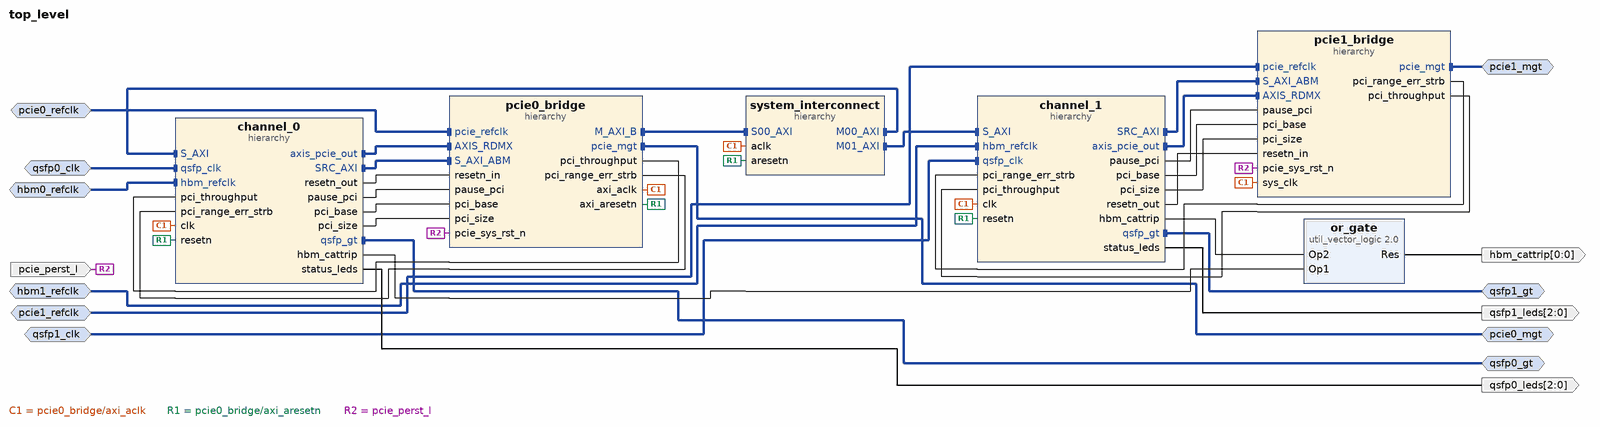
[diagram p0: block diagram of the top level]
# Vivado block design top_level, xcu55c-fsvh2892-2L-e, Vivado 2024.2
create_bd_design top_level

create_bd_intf_port -mode Slave -vlnv xilinx.com:interface:diff_clock_rtl:1.0 pcie0_refclk
create_bd_intf_port -mode Master -vlnv xilinx.com:interface:pcie_7x_mgt_rtl:1.0 pcie0_mgt
create_bd_intf_port -mode Slave -vlnv xilinx.com:interface:diff_clock_rtl:1.0 qsfp0_clk
set_property -dict {CONFIG.FREQ_HZ 161132812} [get_bd_intf_ports qsfp0_clk]
create_bd_intf_port -mode Master -vlnv xilinx.com:interface:gt_rtl:1.0 qsfp0_gt
create_bd_intf_port -mode Slave -vlnv xilinx.com:interface:diff_clock_rtl:1.0 hbm0_refclk
create_bd_intf_port -mode Master -vlnv xilinx.com:interface:pcie_7x_mgt_rtl:1.0 pcie1_mgt
create_bd_intf_port -mode Slave -vlnv xilinx.com:interface:diff_clock_rtl:1.0 pcie1_refclk
create_bd_intf_port -mode Slave -vlnv xilinx.com:interface:diff_clock_rtl:1.0 qsfp1_clk
set_property -dict {CONFIG.FREQ_HZ 161132812} [get_bd_intf_ports qsfp1_clk]
create_bd_intf_port -mode Master -vlnv xilinx.com:interface:gt_rtl:1.0 qsfp1_gt
create_bd_intf_port -mode Slave -vlnv xilinx.com:interface:diff_clock_rtl:1.0 hbm1_refclk
create_bd_port -dir O -from 2 -to 0 qsfp0_leds
create_bd_port -dir O -from 2 -to 0 qsfp1_leds
create_bd_port -dir I -type rst pcie_perst_l
create_bd_port -dir O -from 0 -to 0 hbm_cattrip

create_bd_cell -type hier pcie0_bridge
create_bd_cell -type hier system_interconnect
create_bd_cell -type hier channel_0
create_bd_cell -type hier pcie1_bridge
create_bd_cell -type hier channel_1
create_bd_cell -type ip -vlnv xilinx.com:ip:util_vector_logic:2.0 or_gate
set_property -dict {CONFIG.C_OPERATION or CONFIG.C_SIZE 1} [get_bd_cells or_gate]

# ---- hierarchy /pcie0_bridge ----
current_bd_instance /pcie0_bridge
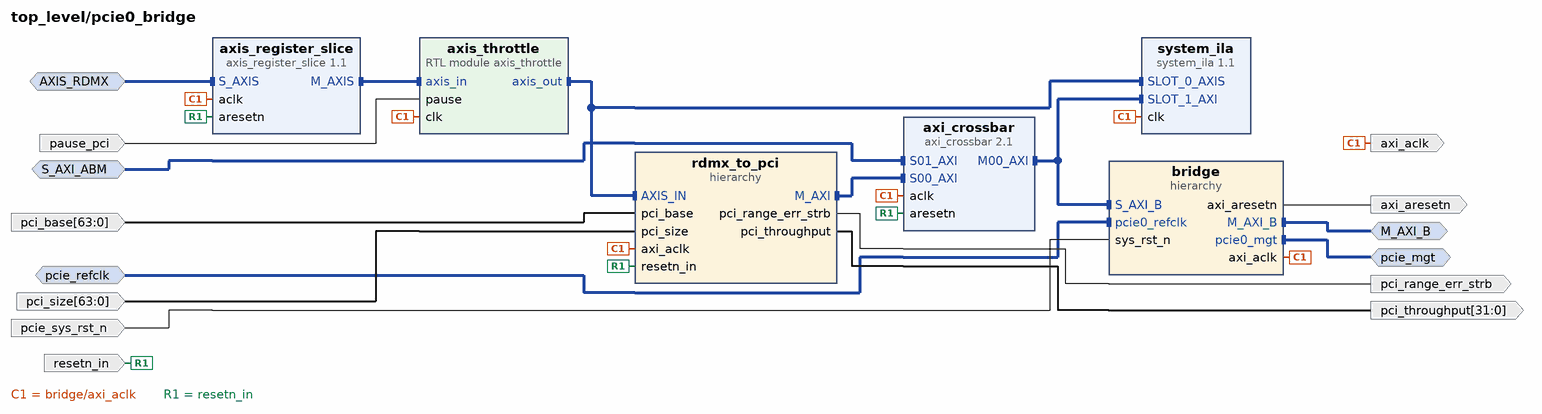
[diagram p1: block diagram inside /pcie0_bridge]
create_bd_intf_pin -mode Master -vlnv xilinx.com:interface:pcie_7x_mgt_rtl:1.0 pcie_mgt
create_bd_intf_pin -mode Slave -vlnv xilinx.com:interface:diff_clock_rtl:1.0 pcie_refclk
create_bd_intf_pin -mode Master -vlnv xilinx.com:interface:aximm_rtl:1.0 M_AXI_B
create_bd_intf_pin -mode Slave -vlnv xilinx.com:interface:axis_rtl:1.0 AXIS_RDMX
create_bd_intf_pin -mode Slave -vlnv xilinx.com:interface:aximm_rtl:1.0 S_AXI_ABM
create_bd_pin -dir O axi_aclk
create_bd_pin -dir O axi_aresetn
create_bd_pin -dir I resetn_in
create_bd_pin -dir O pci_range_err_strb
create_bd_pin -dir I pause_pci
create_bd_pin -dir I -from 63 -to 0 pci_base
create_bd_pin -dir I -from 63 -to 0 pci_size
create_bd_pin -dir I pcie_sys_rst_n
create_bd_pin -dir O -from 31 -to 0 pci_throughput

create_bd_cell -type ip -vlnv xilinx.com:ip:axis_register_slice:1.1 axis_register_slice
set_property -dict {CONFIG.REG_CONFIG 8} [get_bd_cells axis_register_slice]
create_bd_cell -type module -reference axis_throttle axis_throttle
create_bd_cell -type ip -vlnv xilinx.com:ip:system_ila:1.1 system_ila
set_property -dict [list \
  CONFIG.C_MON_TYPE INTERFACE \
  CONFIG.C_NUM_MONITOR_SLOTS 2 \
  CONFIG.C_SLOT_0_INTF_TYPE xilinx.com:interface:axis_rtl:1.0 \
] [get_bd_cells system_ila]
create_bd_cell -type hier bridge
create_bd_cell -type ip -vlnv xilinx.com:ip:axi_crossbar:2.1 axi_crossbar
set_property -dict {CONFIG.NUM_MI 1 CONFIG.NUM_SI 2 CONFIG.STRATEGY 2} [get_bd_cells axi_crossbar]
create_bd_cell -type hier rdmx_to_pci

# ---- hierarchy /pcie0_bridge/bridge ----
current_bd_instance /pcie0_bridge/bridge
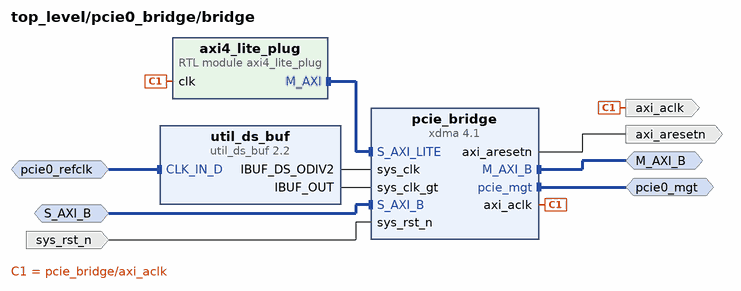
[diagram p2: block diagram inside /pcie0_bridge/bridge]
create_bd_intf_pin -mode Slave -vlnv xilinx.com:interface:diff_clock_rtl:1.0 pcie0_refclk
create_bd_intf_pin -mode Slave -vlnv xilinx.com:interface:aximm_rtl:1.0 S_AXI_B
create_bd_intf_pin -mode Master -vlnv xilinx.com:interface:aximm_rtl:1.0 M_AXI_B
create_bd_intf_pin -mode Master -vlnv xilinx.com:interface:pcie_7x_mgt_rtl:1.0 pcie0_mgt
create_bd_pin -dir O -type clk axi_aclk
create_bd_pin -dir I -type rst sys_rst_n
create_bd_pin -dir O -type rst axi_aresetn

create_bd_cell -type module -reference axi4_lite_plug axi4_lite_plug
create_bd_cell -type ip -vlnv xilinx.com:ip:util_ds_buf:2.2 util_ds_buf
set_property -dict {CONFIG.C_BUF_TYPE IBUFDSGTE} [get_bd_cells util_ds_buf]
create_bd_cell -type ip -vlnv xilinx.com:ip:xdma:4.1 pcie_bridge
set_property -dict [list \
  CONFIG.axi_addr_width 64 \
  CONFIG.functional_mode AXI_Bridge \
  CONFIG.mode_selection Advanced \
  CONFIG.pcie_blk_locn PCIE4C_X1Y1 \
  CONFIG.pf0_device_id 903f \
  CONFIG.pl_link_cap_max_link_speed 16.0_GT/s \
  CONFIG.pl_link_cap_max_link_width X8 \
] [get_bd_cells pcie_bridge]

# ---- hierarchy /pcie0_bridge/rdmx_to_pci ----
current_bd_instance /pcie0_bridge/rdmx_to_pci
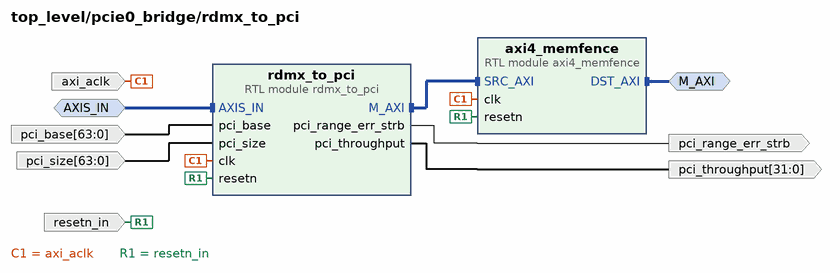
[diagram p3: block diagram inside /pcie0_bridge/rdmx_to_pci]
create_bd_intf_pin -mode Slave -vlnv xilinx.com:interface:axis_rtl:1.0 AXIS_IN
create_bd_intf_pin -mode Master -vlnv xilinx.com:interface:aximm_rtl:1.0 M_AXI
create_bd_pin -dir I -type clk axi_aclk
create_bd_pin -dir I resetn_in
create_bd_pin -dir I -from 63 -to 0 pci_base
create_bd_pin -dir I -from 63 -to 0 pci_size
create_bd_pin -dir O pci_range_err_strb
create_bd_pin -dir O -from 31 -to 0 pci_throughput

create_bd_cell -type module -reference rdmx_to_pci rdmx_to_pci
create_bd_cell -type module -reference axi4_memfence axi4_memfence

# ---- hierarchy /system_interconnect ----
current_bd_instance /system_interconnect
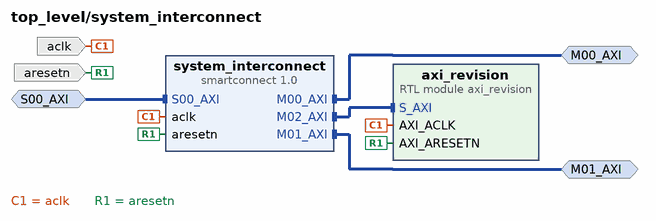
[diagram p4: block diagram inside /system_interconnect]
create_bd_intf_pin -mode Slave -vlnv xilinx.com:interface:aximm_rtl:1.0 S00_AXI
create_bd_intf_pin -mode Master -vlnv xilinx.com:interface:aximm_rtl:1.0 M01_AXI
create_bd_intf_pin -mode Master -vlnv xilinx.com:interface:aximm_rtl:1.0 M00_AXI
create_bd_pin -dir I -type clk aclk
create_bd_pin -dir I -type rst aresetn

create_bd_cell -type module -reference axi_revision axi_revision
create_bd_cell -type ip -vlnv xilinx.com:ip:smartconnect:1.0 system_interconnect
set_property -dict {CONFIG.NUM_MI 3 CONFIG.NUM_SI 1} [get_bd_cells system_interconnect]

# ---- hierarchy /channel_0 ----
current_bd_instance /channel_0
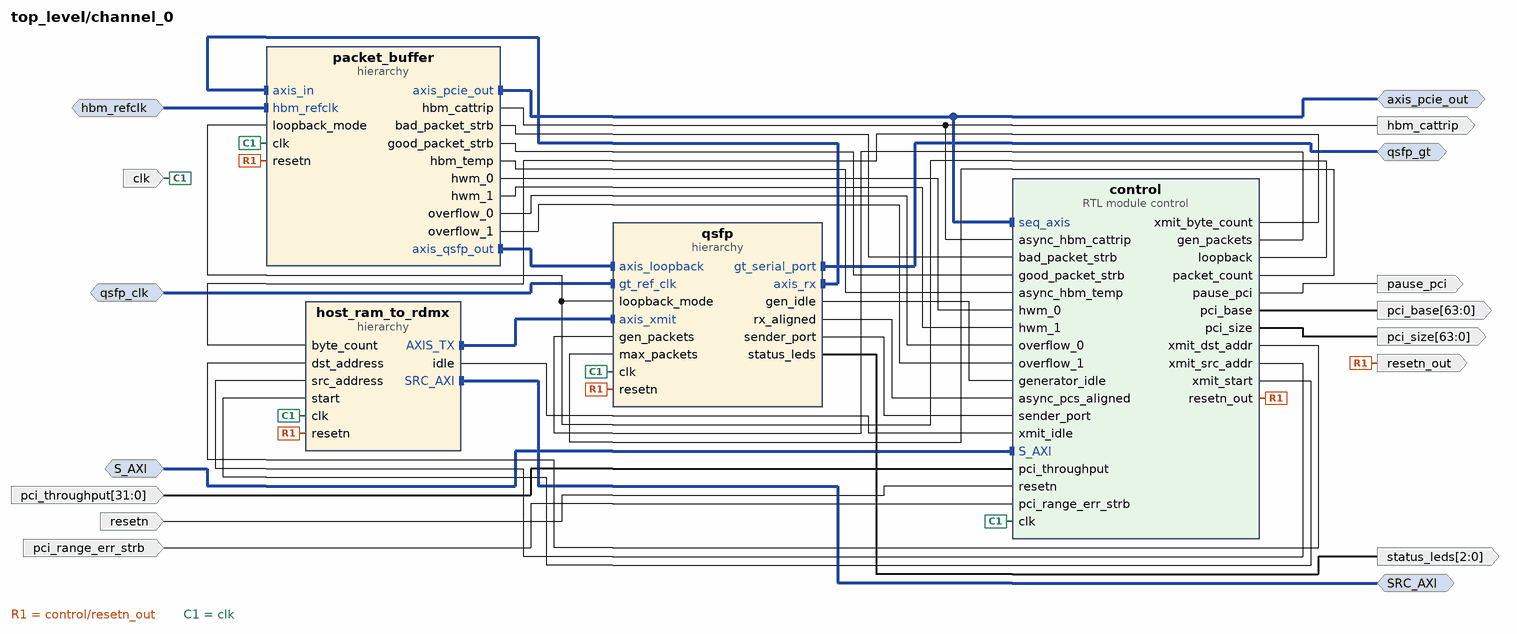
[diagram p5: block diagram inside /channel_0]
create_bd_intf_pin -mode Master -vlnv xilinx.com:interface:axis_rtl:1.0 axis_pcie_out
create_bd_intf_pin -mode Slave -vlnv xilinx.com:interface:aximm_rtl:1.0 S_AXI
create_bd_intf_pin -mode Master -vlnv xilinx.com:interface:aximm_rtl:1.0 SRC_AXI
create_bd_intf_pin -mode Slave -vlnv xilinx.com:interface:diff_clock_rtl:1.0 qsfp_clk
create_bd_intf_pin -mode Master -vlnv xilinx.com:interface:gt_rtl:1.0 qsfp_gt
create_bd_intf_pin -mode Slave -vlnv xilinx.com:interface:diff_clock_rtl:1.0 hbm_refclk
create_bd_pin -dir I -type clk clk
create_bd_pin -dir I -type rst resetn
create_bd_pin -dir O pause_pci
create_bd_pin -dir I pci_range_err_strb
create_bd_pin -dir O resetn_out
create_bd_pin -dir O -from 63 -to 0 pci_base
create_bd_pin -dir O -from 63 -to 0 pci_size
create_bd_pin -dir O -from 2 -to 0 status_leds
create_bd_pin -dir O hbm_cattrip
create_bd_pin -dir I -from 31 -to 0 pci_throughput

create_bd_cell -type hier host_ram_to_rdmx
create_bd_cell -type hier packet_buffer
create_bd_cell -type hier qsfp
create_bd_cell -type module -reference control control

# ---- hierarchy /channel_0/host_ram_to_rdmx ----
current_bd_instance /channel_0/host_ram_to_rdmx
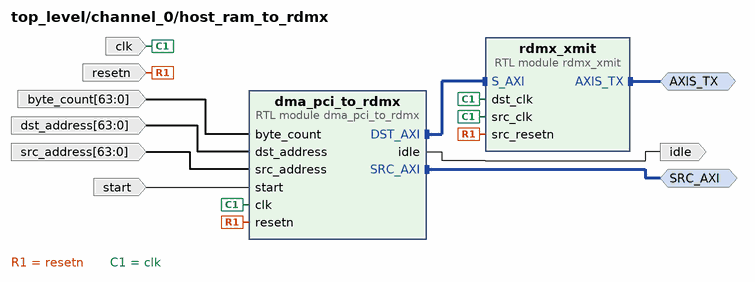
[diagram p6: block diagram inside /channel_0/host_ram_to_rdmx]
create_bd_intf_pin -mode Master -vlnv xilinx.com:interface:aximm_rtl:1.0 SRC_AXI
create_bd_intf_pin -mode Master -vlnv xilinx.com:interface:axis_rtl:1.0 AXIS_TX
create_bd_pin -dir I -type clk clk
create_bd_pin -dir I -type rst resetn
create_bd_pin -dir I -from 63 -to 0 src_address
create_bd_pin -dir I start
create_bd_pin -dir O idle
create_bd_pin -dir I -from 63 -to 0 dst_address
create_bd_pin -dir I -from 63 -to 0 byte_count

create_bd_cell -type module -reference rdmx_xmit rdmx_xmit
set_property -dict {CONFIG.FIFO_CLOCK_MODE common_clock CONFIG.SRC_MAC 0} [get_bd_cells rdmx_xmit]
create_bd_cell -type module -reference dma_pci_to_rdmx dma_pci_to_rdmx

# ---- hierarchy /channel_0/packet_buffer ----
current_bd_instance /channel_0/packet_buffer
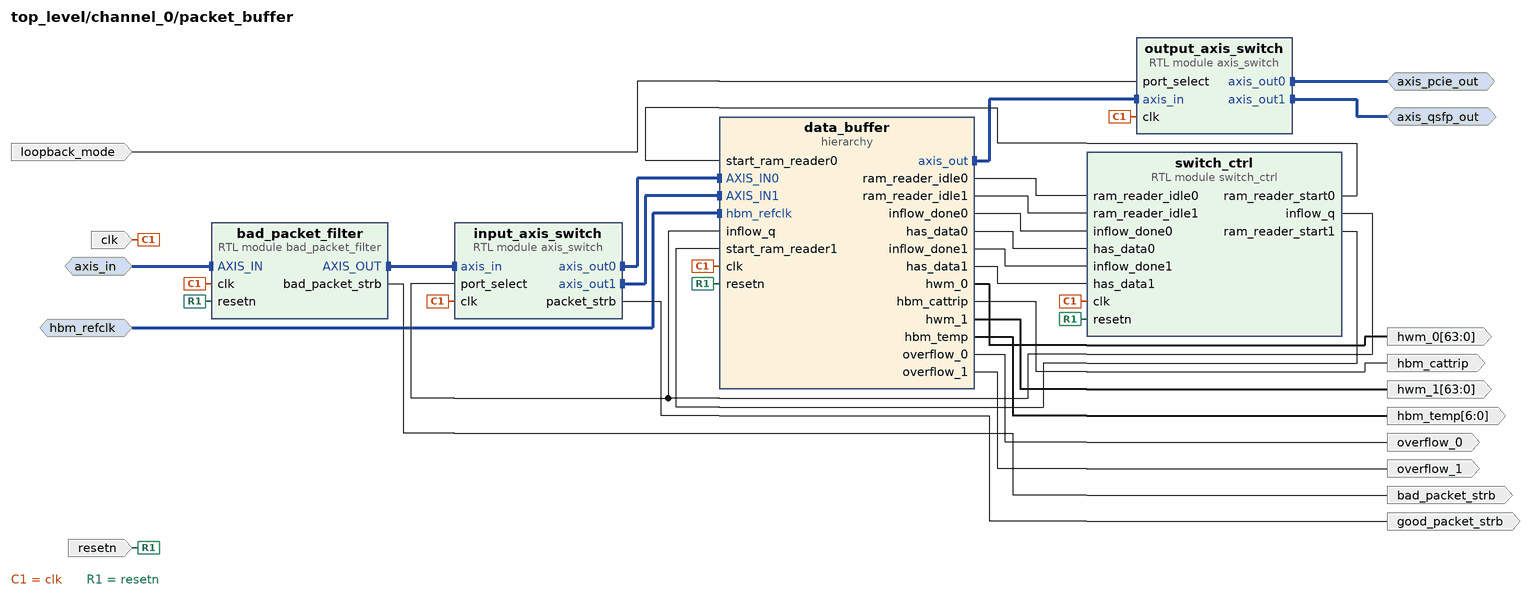
[diagram p7: block diagram inside /channel_0/packet_buffer]
create_bd_intf_pin -mode Slave -vlnv xilinx.com:interface:axis_rtl:1.0 axis_in
create_bd_intf_pin -mode Master -vlnv xilinx.com:interface:axis_rtl:1.0 axis_pcie_out
create_bd_intf_pin -mode Master -vlnv xilinx.com:interface:axis_rtl:1.0 axis_qsfp_out
create_bd_intf_pin -mode Slave -vlnv xilinx.com:interface:diff_clock_rtl:1.0 hbm_refclk
create_bd_pin -dir I -type clk clk
create_bd_pin -dir I resetn
create_bd_pin -dir O -from 63 -to 0 hwm_0
create_bd_pin -dir O -from 63 -to 0 hwm_1
create_bd_pin -dir I loopback_mode
create_bd_pin -dir O overflow_0
create_bd_pin -dir O overflow_1
create_bd_pin -dir O bad_packet_strb
create_bd_pin -dir O good_packet_strb
create_bd_pin -dir O -from 6 -to 0 hbm_temp
create_bd_pin -dir O hbm_cattrip

create_bd_cell -type module -reference axis_switch input_axis_switch
create_bd_cell -type module -reference axis_switch output_axis_switch
create_bd_cell -type module -reference switch_ctrl switch_ctrl
create_bd_cell -type hier data_buffer
create_bd_cell -type module -reference bad_packet_filter bad_packet_filter

# ---- hierarchy /channel_0/packet_buffer/data_buffer ----
current_bd_instance /channel_0/packet_buffer/data_buffer
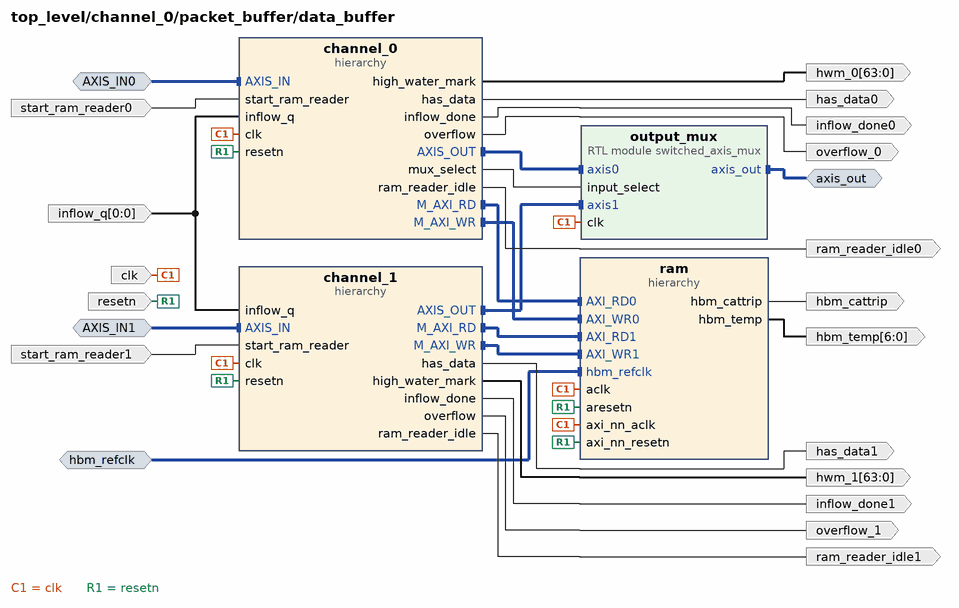
[diagram p8: block diagram inside /channel_0/packet_buffer/data_buffer]
create_bd_intf_pin -mode Slave -vlnv xilinx.com:interface:diff_clock_rtl:1.0 hbm_refclk
create_bd_intf_pin -mode Slave -vlnv xilinx.com:interface:axis_rtl:1.0 AXIS_IN0
create_bd_intf_pin -mode Slave -vlnv xilinx.com:interface:axis_rtl:1.0 AXIS_IN1
create_bd_intf_pin -mode Master -vlnv xilinx.com:interface:axis_rtl:1.0 axis_out
create_bd_pin -dir I -type clk clk
create_bd_pin -dir I resetn
create_bd_pin -dir O -from 6 -to 0 hbm_temp
create_bd_pin -dir O hbm_cattrip
create_bd_pin -dir I -from 0 -to 0 inflow_q
create_bd_pin -dir O ram_reader_idle0
create_bd_pin -dir I start_ram_reader0
create_bd_pin -dir O has_data0
create_bd_pin -dir O inflow_done0
create_bd_pin -dir O -from 63 -to 0 hwm_0
create_bd_pin -dir O overflow_0
create_bd_pin -dir O has_data1
create_bd_pin -dir O inflow_done1
create_bd_pin -dir O -from 63 -to 0 hwm_1
create_bd_pin -dir O overflow_1
create_bd_pin -dir O ram_reader_idle1
create_bd_pin -dir I start_ram_reader1

create_bd_cell -type hier ram
create_bd_cell -type hier channel_0
create_bd_cell -type hier channel_1
create_bd_cell -type module -reference switched_axis_mux output_mux

# ---- hierarchy /channel_0/packet_buffer/data_buffer/ram ----
current_bd_instance /channel_0/packet_buffer/data_buffer/ram
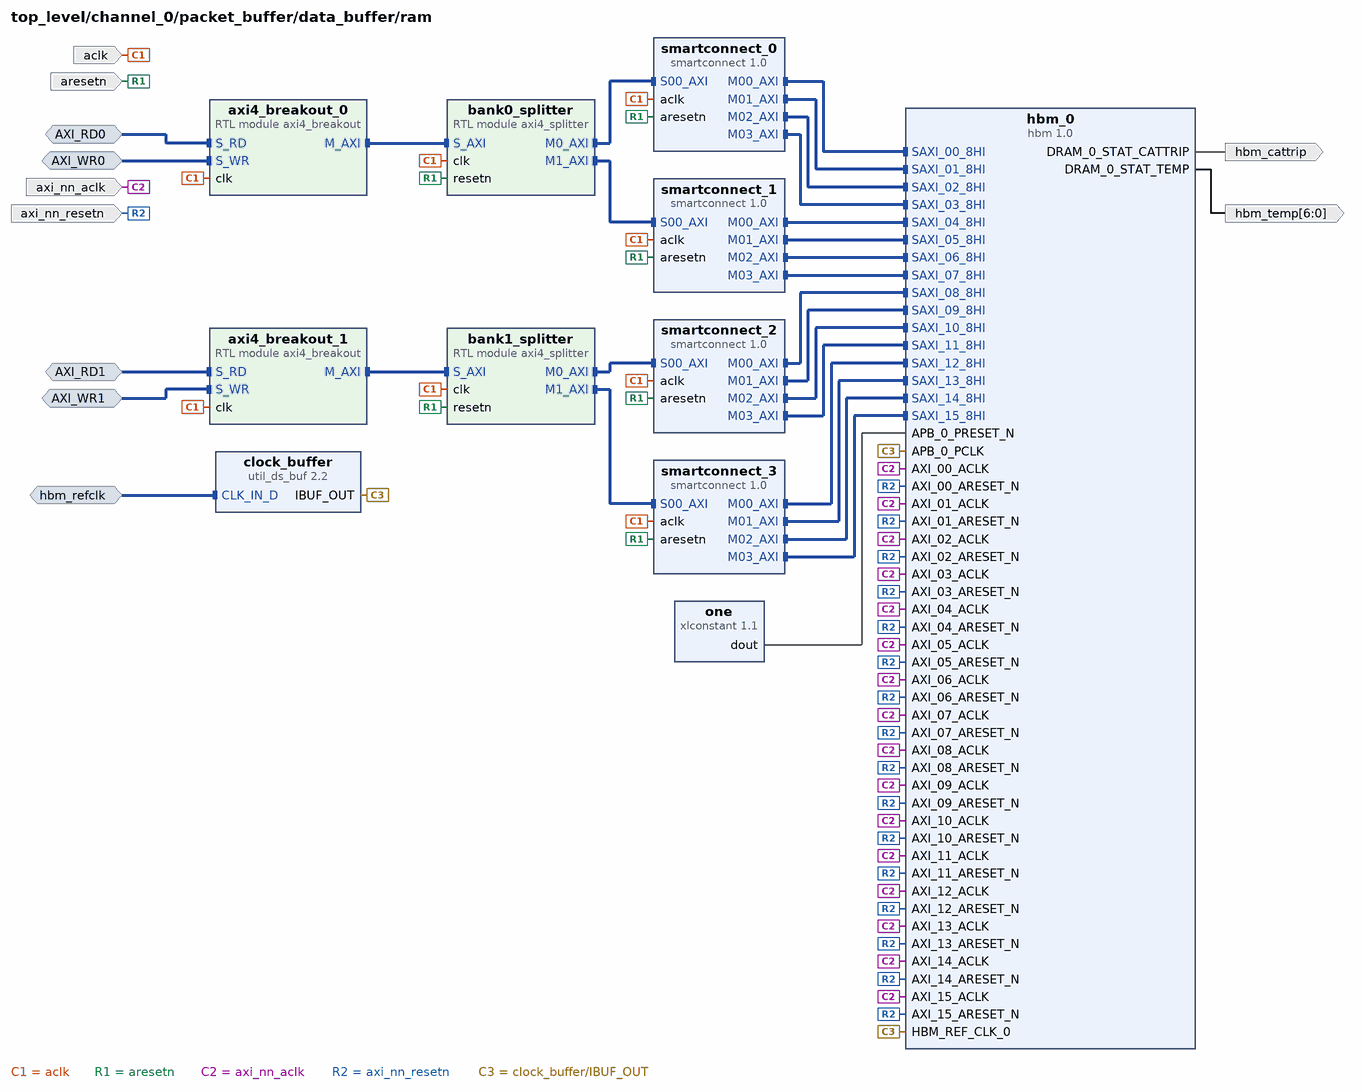
[diagram p9: block diagram inside /channel_0/packet_buffer/data_buffer/ram]
create_bd_intf_pin -mode Slave -vlnv xilinx.com:interface:aximm_rtl:1.0 AXI_WR1
create_bd_intf_pin -mode Slave -vlnv xilinx.com:interface:aximm_rtl:1.0 AXI_RD1
create_bd_intf_pin -mode Slave -vlnv xilinx.com:interface:aximm_rtl:1.0 AXI_WR0
create_bd_intf_pin -mode Slave -vlnv xilinx.com:interface:aximm_rtl:1.0 AXI_RD0
create_bd_intf_pin -mode Slave -vlnv xilinx.com:interface:diff_clock_rtl:1.0 hbm_refclk
create_bd_pin -dir I -type clk axi_nn_aclk
create_bd_pin -dir I axi_nn_resetn
create_bd_pin -dir O -from 6 -to 0 hbm_temp
create_bd_pin -dir O hbm_cattrip
create_bd_pin -dir I aclk
create_bd_pin -dir I aresetn

create_bd_cell -type ip -vlnv xilinx.com:ip:hbm:1.0 hbm_0
set_property -dict [list \
  CONFIG.USER_APB_EN false \
  CONFIG.USER_MC0_ENABLE_ECC_CORRECTION true \
  CONFIG.USER_MC0_TRAFFIC_OPTION Linear \
  CONFIG.USER_MC10_ENABLE_ECC_CORRECTION true \
  CONFIG.USER_MC10_TRAFFIC_OPTION Linear \
  CONFIG.USER_MC11_ENABLE_ECC_CORRECTION true \
  CONFIG.USER_MC11_TRAFFIC_OPTION Linear \
  CONFIG.USER_MC12_ENABLE_ECC_CORRECTION true \
  CONFIG.USER_MC12_TRAFFIC_OPTION Linear \
  CONFIG.USER_MC13_ENABLE_ECC_CORRECTION true \
  CONFIG.USER_MC13_TRAFFIC_OPTION Linear \
  CONFIG.USER_MC14_ENABLE_ECC_CORRECTION true \
  CONFIG.USER_MC14_TRAFFIC_OPTION Linear \
  CONFIG.USER_MC15_ENABLE_ECC_CORRECTION true \
  CONFIG.USER_MC15_TRAFFIC_OPTION Linear \
  CONFIG.USER_MC1_ENABLE_ECC_CORRECTION true \
  CONFIG.USER_MC1_TRAFFIC_OPTION Linear \
  CONFIG.USER_MC2_ENABLE_ECC_CORRECTION true \
  CONFIG.USER_MC2_TRAFFIC_OPTION Linear \
  CONFIG.USER_MC3_ENABLE_ECC_CORRECTION true \
  CONFIG.USER_MC3_TRAFFIC_OPTION Linear \
  CONFIG.USER_MC4_ENABLE_ECC_CORRECTION true \
  CONFIG.USER_MC4_TRAFFIC_OPTION Linear \
  CONFIG.USER_MC5_ENABLE_ECC_CORRECTION true \
  CONFIG.USER_MC5_TRAFFIC_OPTION Linear \
  CONFIG.USER_MC6_ENABLE_ECC_CORRECTION true \
  CONFIG.USER_MC6_TRAFFIC_OPTION Linear \
  CONFIG.USER_MC7_ENABLE_ECC_CORRECTION true \
  CONFIG.USER_MC7_TRAFFIC_OPTION Linear \
  CONFIG.USER_MC8_ENABLE_ECC_CORRECTION true \
  CONFIG.USER_MC8_TRAFFIC_OPTION Linear \
  CONFIG.USER_MC9_ENABLE_ECC_CORRECTION true \
  CONFIG.USER_MC9_TRAFFIC_OPTION Linear \
  CONFIG.USER_SWITCH_ENABLE_00 FALSE \
] [get_bd_cells hbm_0]
create_bd_cell -type ip -vlnv xilinx.com:ip:smartconnect:1.0 smartconnect_0
set_property -dict {CONFIG.NUM_MI 4 CONFIG.NUM_SI 1} [get_bd_cells smartconnect_0]
create_bd_cell -type ip -vlnv xilinx.com:ip:smartconnect:1.0 smartconnect_1
set_property -dict {CONFIG.NUM_MI 4 CONFIG.NUM_SI 1} [get_bd_cells smartconnect_1]
create_bd_cell -type ip -vlnv xilinx.com:ip:smartconnect:1.0 smartconnect_2
set_property -dict {CONFIG.NUM_MI 4 CONFIG.NUM_SI 1} [get_bd_cells smartconnect_2]
create_bd_cell -type ip -vlnv xilinx.com:ip:smartconnect:1.0 smartconnect_3
set_property -dict {CONFIG.NUM_MI 4 CONFIG.NUM_SI 1} [get_bd_cells smartconnect_3]
create_bd_cell -type ip -vlnv xilinx.com:ip:xlconstant:1.1 one
create_bd_cell -type ip -vlnv xilinx.com:ip:util_ds_buf:2.2 clock_buffer
create_bd_cell -type module -reference axi4_breakout axi4_breakout_0
create_bd_cell -type module -reference axi4_breakout axi4_breakout_1
create_bd_cell -type module -reference axi4_splitter bank0_splitter
set_property -dict {CONFIG.BASE_ADDR1 0x0000000080000000} [get_bd_cells bank0_splitter]
create_bd_cell -type module -reference axi4_splitter bank1_splitter
set_property -dict {CONFIG.BASE_ADDR0 0x0000000100000000 CONFIG.BASE_ADDR1 0x0000000180000000} [get_bd_cells bank1_splitter]

# ---- hierarchy /channel_0/packet_buffer/data_buffer/channel_0 ----
current_bd_instance /channel_0/packet_buffer/data_buffer/channel_0
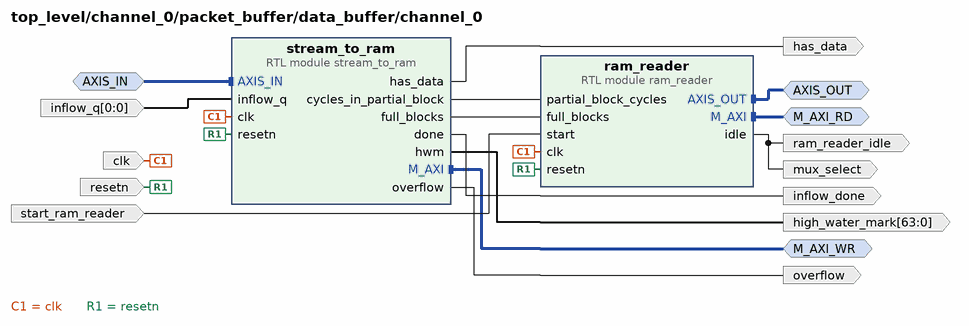
[diagram p10: block diagram inside /channel_0/packet_buffer/data_buffer/channel_0]
create_bd_intf_pin -mode Slave -vlnv xilinx.com:interface:axis_rtl:1.0 AXIS_IN
create_bd_intf_pin -mode Master -vlnv xilinx.com:interface:axis_rtl:1.0 AXIS_OUT
create_bd_intf_pin -mode Master -vlnv xilinx.com:interface:aximm_rtl:1.0 M_AXI_WR
create_bd_intf_pin -mode Master -vlnv xilinx.com:interface:aximm_rtl:1.0 M_AXI_RD
create_bd_pin -dir I -type clk clk
create_bd_pin -dir I resetn
create_bd_pin -dir I -from 0 -to 0 inflow_q
create_bd_pin -dir O ram_reader_idle
create_bd_pin -dir I start_ram_reader
create_bd_pin -dir O has_data
create_bd_pin -dir O inflow_done
create_bd_pin -dir O -from 63 -to 0 high_water_mark
create_bd_pin -dir O overflow
create_bd_pin -dir O mux_select

create_bd_cell -type module -reference stream_to_ram stream_to_ram
create_bd_cell -type module -reference ram_reader ram_reader

# ---- hierarchy /channel_0/packet_buffer/data_buffer/channel_1 ----
current_bd_instance /channel_0/packet_buffer/data_buffer/channel_1
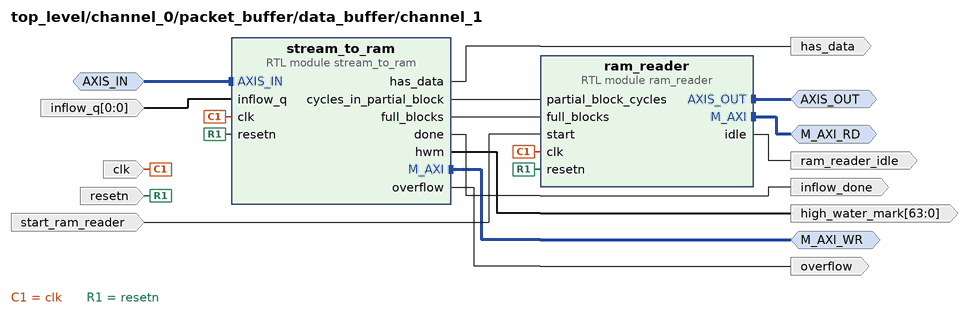
[diagram p11: block diagram inside /channel_0/packet_buffer/data_buffer/channel_1]
create_bd_intf_pin -mode Slave -vlnv xilinx.com:interface:axis_rtl:1.0 AXIS_IN
create_bd_intf_pin -mode Master -vlnv xilinx.com:interface:aximm_rtl:1.0 M_AXI_WR
create_bd_intf_pin -mode Master -vlnv xilinx.com:interface:axis_rtl:1.0 AXIS_OUT
create_bd_intf_pin -mode Master -vlnv xilinx.com:interface:aximm_rtl:1.0 M_AXI_RD
create_bd_pin -dir I -type clk clk
create_bd_pin -dir I resetn
create_bd_pin -dir I -from 0 -to 0 inflow_q
create_bd_pin -dir O has_data
create_bd_pin -dir O inflow_done
create_bd_pin -dir O -from 63 -to 0 high_water_mark
create_bd_pin -dir O overflow
create_bd_pin -dir O ram_reader_idle
create_bd_pin -dir I start_ram_reader

create_bd_cell -type module -reference stream_to_ram stream_to_ram
set_property -dict {CONFIG.CHANNEL 1} [get_bd_cells stream_to_ram]
create_bd_cell -type module -reference ram_reader ram_reader

# ---- hierarchy /channel_0/qsfp ----
current_bd_instance /channel_0/qsfp
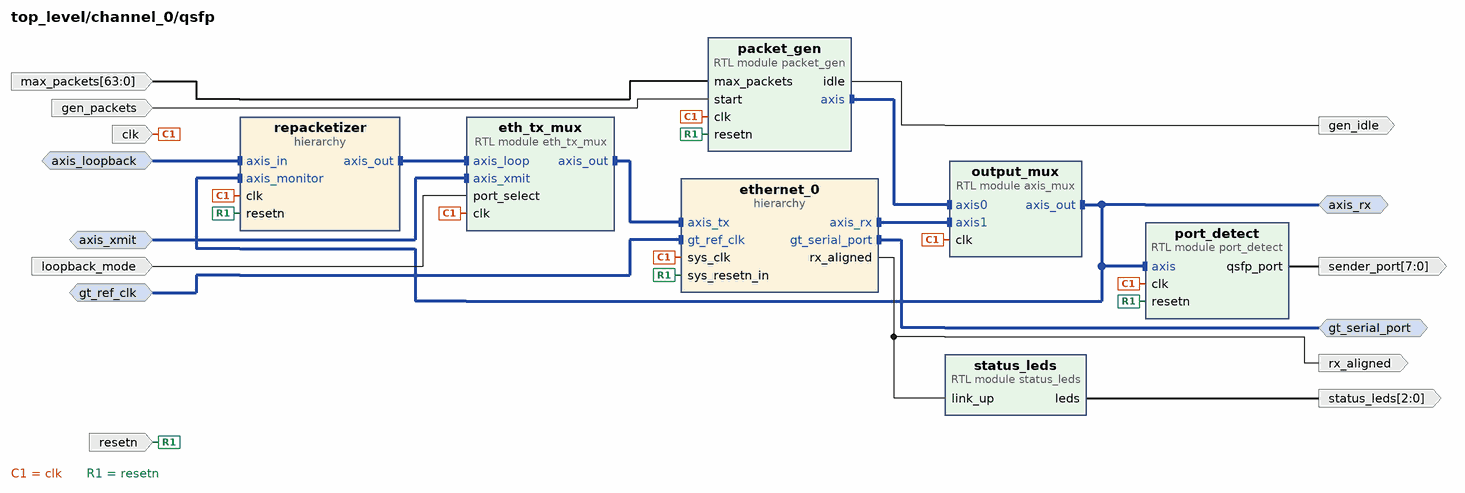
[diagram p12: block diagram inside /channel_0/qsfp]
create_bd_intf_pin -mode Master -vlnv xilinx.com:interface:axis_rtl:1.0 axis_rx
create_bd_intf_pin -mode Slave -vlnv xilinx.com:interface:diff_clock_rtl:1.0 gt_ref_clk
create_bd_intf_pin -mode Master -vlnv xilinx.com:interface:gt_rtl:1.0 gt_serial_port
create_bd_intf_pin -mode Slave -vlnv xilinx.com:interface:axis_rtl:1.0 axis_loopback
create_bd_intf_pin -mode Slave -vlnv xilinx.com:interface:axis_rtl:1.0 axis_xmit
create_bd_pin -dir I -type clk clk
create_bd_pin -dir I -type rst resetn
create_bd_pin -dir I gen_packets
create_bd_pin -dir I -from 63 -to 0 max_packets
create_bd_pin -dir O gen_idle
create_bd_pin -dir O rx_aligned
create_bd_pin -dir I loopback_mode
create_bd_pin -dir O -from 2 -to 0 status_leds
create_bd_pin -dir O -from 7 -to 0 sender_port

create_bd_cell -type hier ethernet_0
create_bd_cell -type hier repacketizer
create_bd_cell -type module -reference axis_mux output_mux
create_bd_cell -type module -reference eth_tx_mux eth_tx_mux
create_bd_cell -type module -reference packet_gen packet_gen
create_bd_cell -type module -reference status_leds status_leds
create_bd_cell -type module -reference port_detect port_detect

# ---- hierarchy /channel_0/qsfp/ethernet_0 ----
current_bd_instance /channel_0/qsfp/ethernet_0
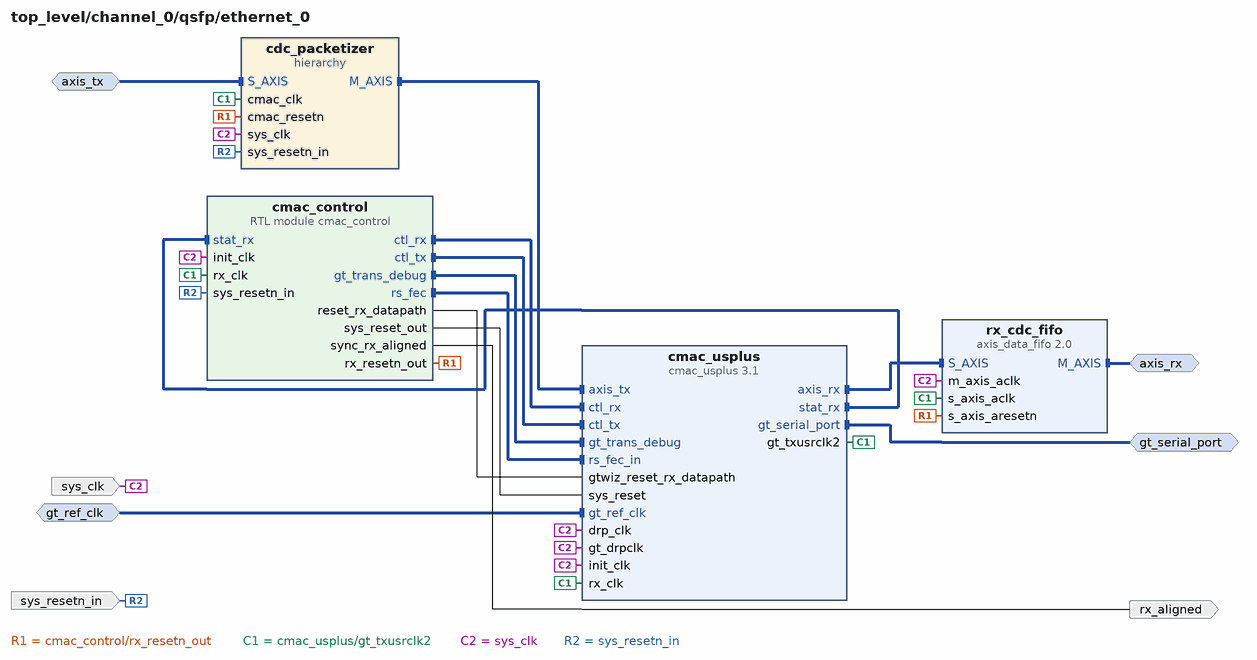
[diagram p13: block diagram inside /channel_0/qsfp/ethernet_0]
create_bd_intf_pin -mode Master -vlnv xilinx.com:interface:gt_rtl:1.0 gt_serial_port
create_bd_intf_pin -mode Slave -vlnv xilinx.com:interface:diff_clock_rtl:1.0 gt_ref_clk
create_bd_intf_pin -mode Master -vlnv xilinx.com:interface:axis_rtl:1.0 axis_rx
create_bd_intf_pin -mode Slave -vlnv xilinx.com:interface:axis_rtl:1.0 axis_tx
create_bd_pin -dir O rx_aligned
create_bd_pin -dir I sys_resetn_in
create_bd_pin -dir I sys_clk

create_bd_cell -type hier cdc_packetizer
create_bd_cell -type ip -vlnv xilinx.com:ip:axis_data_fifo:2.0 rx_cdc_fifo
set_property -dict {CONFIG.FIFO_DEPTH 16 CONFIG.IS_ACLK_ASYNC 1} [get_bd_cells rx_cdc_fifo]
create_bd_cell -type module -reference cmac_control cmac_control
create_bd_cell -type ip -vlnv xilinx.com:ip:cmac_usplus:3.1 cmac_usplus
set_property -dict [list \
  CONFIG.ADD_GT_CNRL_STS_PORTS 1 \
  CONFIG.CMAC_CAUI4_MODE 1 \
  CONFIG.CMAC_CORE_SELECT CMACE4_X0Y3 \
  CONFIG.GT_DRP_CLK 250 \
  CONFIG.GT_GROUP_SELECT {X0Y24~X0Y27} \
  CONFIG.GT_REF_CLK_FREQ 161.1328125 \
  CONFIG.INCLUDE_RS_FEC 1 \
  CONFIG.NUM_LANES 4x25 \
  CONFIG.RX_FLOW_CONTROL 0 \
  CONFIG.TX_FLOW_CONTROL 0 \
  CONFIG.USER_INTERFACE AXIS \
] [get_bd_cells cmac_usplus]

# ---- hierarchy /channel_0/qsfp/ethernet_0/cdc_packetizer ----
current_bd_instance /channel_0/qsfp/ethernet_0/cdc_packetizer
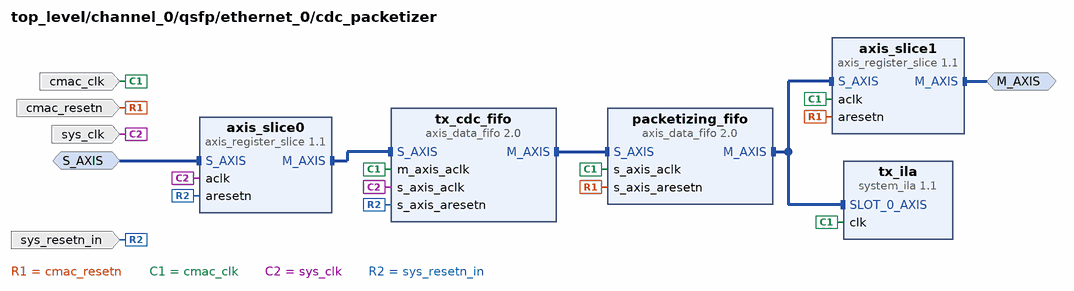
[diagram p14: block diagram inside /channel_0/qsfp/ethernet_0/cdc_packetizer]
create_bd_intf_pin -mode Slave -vlnv xilinx.com:interface:axis_rtl:1.0 S_AXIS
create_bd_intf_pin -mode Master -vlnv xilinx.com:interface:axis_rtl:1.0 M_AXIS
create_bd_pin -dir I sys_resetn_in
create_bd_pin -dir I sys_clk
create_bd_pin -dir I -type clk cmac_clk
create_bd_pin -dir I -type rst cmac_resetn

create_bd_cell -type ip -vlnv xilinx.com:ip:axis_data_fifo:2.0 tx_cdc_fifo
set_property -dict {CONFIG.FIFO_DEPTH 16 CONFIG.IS_ACLK_ASYNC 1} [get_bd_cells tx_cdc_fifo]
create_bd_cell -type ip -vlnv xilinx.com:ip:system_ila:1.1 tx_ila
set_property -dict {CONFIG.C_MON_TYPE INTERFACE CONFIG.C_SLOT_0_INTF_TYPE xilinx.com:interface:axis_rtl:1.0} [get_bd_cells tx_ila]
create_bd_cell -type ip -vlnv xilinx.com:ip:axis_data_fifo:2.0 packetizing_fifo
set_property -dict {CONFIG.FIFO_DEPTH 256 CONFIG.FIFO_MODE 2 CONFIG.IS_ACLK_ASYNC 0} [get_bd_cells packetizing_fifo]
create_bd_cell -type ip -vlnv xilinx.com:ip:axis_register_slice:1.1 axis_slice0
set_property -dict {CONFIG.REG_CONFIG 8} [get_bd_cells axis_slice0]
create_bd_cell -type ip -vlnv xilinx.com:ip:axis_register_slice:1.1 axis_slice1
set_property -dict {CONFIG.REG_CONFIG 8} [get_bd_cells axis_slice1]

# ---- hierarchy /channel_0/qsfp/repacketizer ----
current_bd_instance /channel_0/qsfp/repacketizer
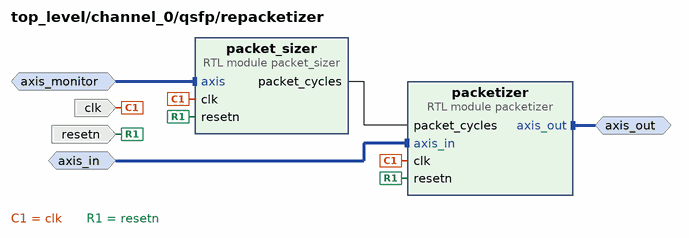
[diagram p15: block diagram inside /channel_0/qsfp/repacketizer]
create_bd_intf_pin -mode Monitor -vlnv xilinx.com:interface:axis_rtl:1.0 axis_monitor
create_bd_intf_pin -mode Slave -vlnv xilinx.com:interface:axis_rtl:1.0 axis_in
create_bd_intf_pin -mode Master -vlnv xilinx.com:interface:axis_rtl:1.0 axis_out
create_bd_pin -dir I -type clk clk
create_bd_pin -dir I -type rst resetn

create_bd_cell -type module -reference packet_sizer packet_sizer
create_bd_cell -type module -reference packetizer packetizer

# ---- hierarchy /pcie1_bridge ----
current_bd_instance /pcie1_bridge
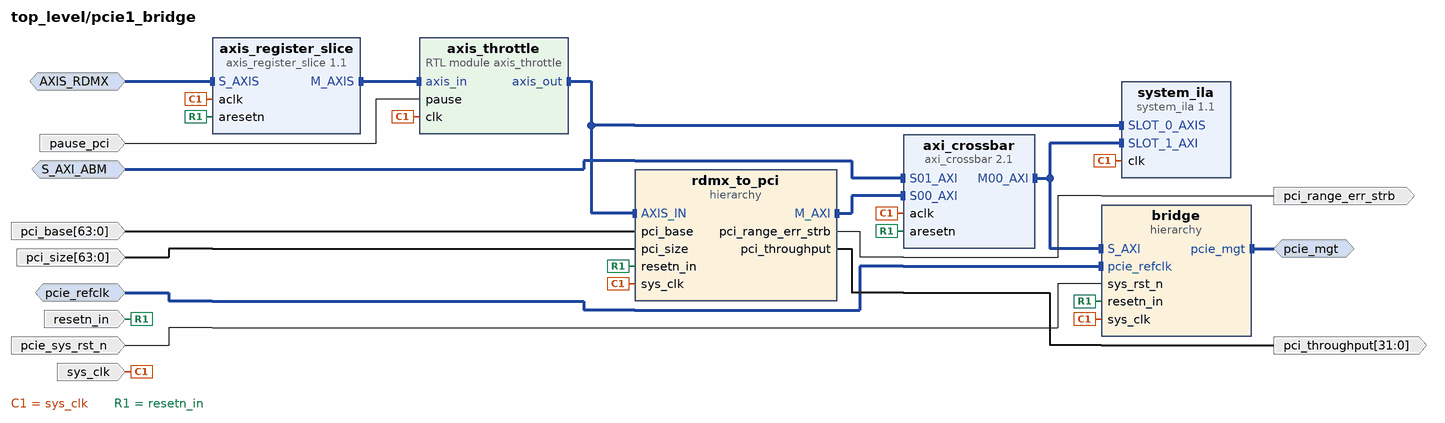
[diagram p16: block diagram inside /pcie1_bridge]
create_bd_intf_pin -mode Master -vlnv xilinx.com:interface:pcie_7x_mgt_rtl:1.0 pcie_mgt
create_bd_intf_pin -mode Slave -vlnv xilinx.com:interface:diff_clock_rtl:1.0 pcie_refclk
create_bd_intf_pin -mode Slave -vlnv xilinx.com:interface:axis_rtl:1.0 AXIS_RDMX
create_bd_intf_pin -mode Slave -vlnv xilinx.com:interface:aximm_rtl:1.0 S_AXI_ABM
create_bd_pin -dir I resetn_in
create_bd_pin -dir O pci_range_err_strb
create_bd_pin -dir I pause_pci
create_bd_pin -dir I -from 63 -to 0 pci_base
create_bd_pin -dir I -from 63 -to 0 pci_size
create_bd_pin -dir I sys_clk
create_bd_pin -dir I -type rst pcie_sys_rst_n
create_bd_pin -dir O -from 31 -to 0 pci_throughput

create_bd_cell -type ip -vlnv xilinx.com:ip:axis_register_slice:1.1 axis_register_slice
set_property -dict {CONFIG.REG_CONFIG 8} [get_bd_cells axis_register_slice]
create_bd_cell -type module -reference axis_throttle axis_throttle
create_bd_cell -type ip -vlnv xilinx.com:ip:system_ila:1.1 system_ila
set_property -dict [list \
  CONFIG.C_MON_TYPE INTERFACE \
  CONFIG.C_NUM_MONITOR_SLOTS 2 \
  CONFIG.C_SLOT_0_INTF_TYPE xilinx.com:interface:axis_rtl:1.0 \
] [get_bd_cells system_ila]
create_bd_cell -type hier bridge
create_bd_cell -type ip -vlnv xilinx.com:ip:axi_crossbar:2.1 axi_crossbar
set_property -dict {CONFIG.NUM_MI 1 CONFIG.NUM_SI 2 CONFIG.STRATEGY 2} [get_bd_cells axi_crossbar]
create_bd_cell -type hier rdmx_to_pci

# ---- hierarchy /pcie1_bridge/bridge ----
current_bd_instance /pcie1_bridge/bridge
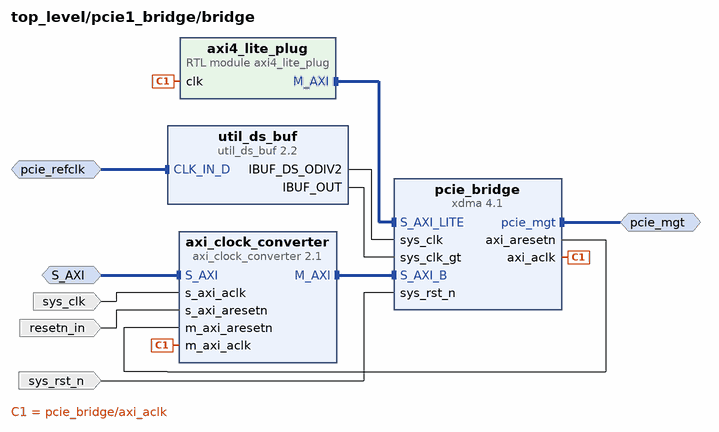
[diagram p17: block diagram inside /pcie1_bridge/bridge]
create_bd_intf_pin -mode Slave -vlnv xilinx.com:interface:aximm_rtl:1.0 S_AXI
create_bd_intf_pin -mode Master -vlnv xilinx.com:interface:pcie_7x_mgt_rtl:1.0 pcie_mgt
create_bd_intf_pin -mode Slave -vlnv xilinx.com:interface:diff_clock_rtl:1.0 pcie_refclk
create_bd_pin -dir I sys_clk
create_bd_pin -dir I resetn_in
create_bd_pin -dir I -type rst sys_rst_n

create_bd_cell -type ip -vlnv xilinx.com:ip:axi_clock_converter:2.1 axi_clock_converter
create_bd_cell -type ip -vlnv xilinx.com:ip:util_ds_buf:2.2 util_ds_buf
set_property -dict {CONFIG.C_BUF_TYPE IBUFDSGTE} [get_bd_cells util_ds_buf]
create_bd_cell -type module -reference axi4_lite_plug axi4_lite_plug
create_bd_cell -type ip -vlnv xilinx.com:ip:xdma:4.1 pcie_bridge
set_property -dict [list \
  CONFIG.axi_addr_width 64 \
  CONFIG.en_axi_master_if false \
  CONFIG.en_gt_selection true \
  CONFIG.functional_mode AXI_Bridge \
  CONFIG.mode_selection Advanced \
  CONFIG.pcie_blk_locn PCIE4C_X1Y0 \
  CONFIG.pf0_device_id 9040 \
  CONFIG.pl_link_cap_max_link_speed 16.0_GT/s \
  CONFIG.pl_link_cap_max_link_width X8 \
  CONFIG.select_quad GTY_Quad_225 \
] [get_bd_cells pcie_bridge]

# ---- hierarchy /pcie1_bridge/rdmx_to_pci ----
current_bd_instance /pcie1_bridge/rdmx_to_pci
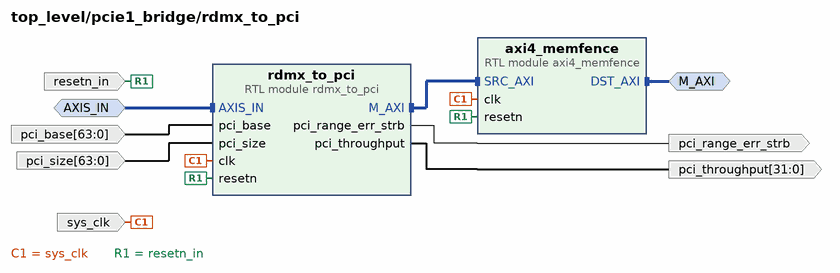
[diagram p18: block diagram inside /pcie1_bridge/rdmx_to_pci]
create_bd_intf_pin -mode Slave -vlnv xilinx.com:interface:axis_rtl:1.0 AXIS_IN
create_bd_intf_pin -mode Master -vlnv xilinx.com:interface:aximm_rtl:1.0 M_AXI
create_bd_pin -dir I sys_clk
create_bd_pin -dir I resetn_in
create_bd_pin -dir I -from 63 -to 0 pci_base
create_bd_pin -dir I -from 63 -to 0 pci_size
create_bd_pin -dir O pci_range_err_strb
create_bd_pin -dir O -from 31 -to 0 pci_throughput

create_bd_cell -type module -reference rdmx_to_pci rdmx_to_pci
create_bd_cell -type module -reference axi4_memfence axi4_memfence

# ---- hierarchy /channel_1 ----
current_bd_instance /channel_1
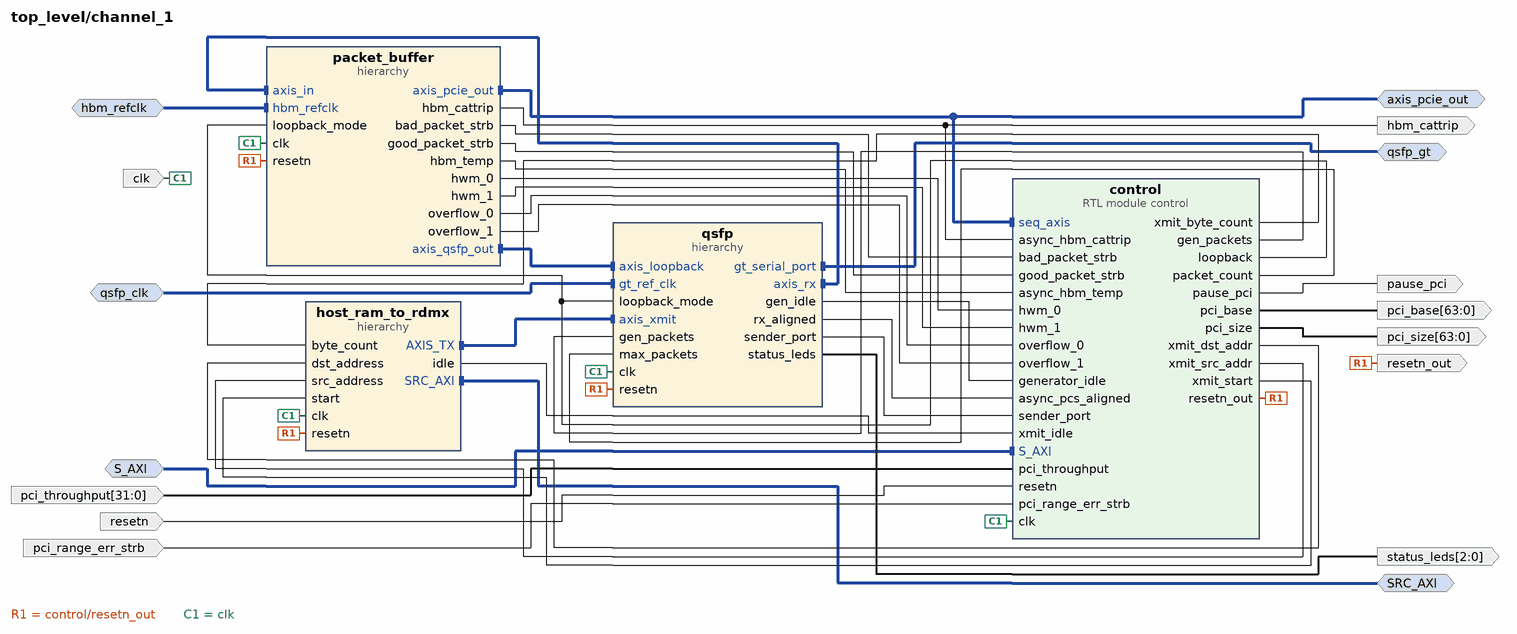
[diagram p19: block diagram inside /channel_1]
create_bd_intf_pin -mode Master -vlnv xilinx.com:interface:axis_rtl:1.0 axis_pcie_out
create_bd_intf_pin -mode Slave -vlnv xilinx.com:interface:aximm_rtl:1.0 S_AXI
create_bd_intf_pin -mode Master -vlnv xilinx.com:interface:aximm_rtl:1.0 SRC_AXI
create_bd_intf_pin -mode Slave -vlnv xilinx.com:interface:diff_clock_rtl:1.0 qsfp_clk
create_bd_intf_pin -mode Master -vlnv xilinx.com:interface:gt_rtl:1.0 qsfp_gt
create_bd_intf_pin -mode Slave -vlnv xilinx.com:interface:diff_clock_rtl:1.0 hbm_refclk
create_bd_pin -dir I -type clk clk
create_bd_pin -dir I -type rst resetn
create_bd_pin -dir O pause_pci
create_bd_pin -dir I pci_range_err_strb
create_bd_pin -dir O resetn_out
create_bd_pin -dir O -from 63 -to 0 pci_base
create_bd_pin -dir O -from 63 -to 0 pci_size
create_bd_pin -dir O -from 2 -to 0 status_leds
create_bd_pin -dir O hbm_cattrip
create_bd_pin -dir I -from 31 -to 0 pci_throughput

create_bd_cell -type hier host_ram_to_rdmx
create_bd_cell -type hier packet_buffer
create_bd_cell -type hier qsfp
create_bd_cell -type module -reference control control
set_property -dict {CONFIG.DEFAULT_PCI_BASE 0x0000000200000000} [get_bd_cells control]

# ---- hierarchy /channel_1/host_ram_to_rdmx ----
current_bd_instance /channel_1/host_ram_to_rdmx
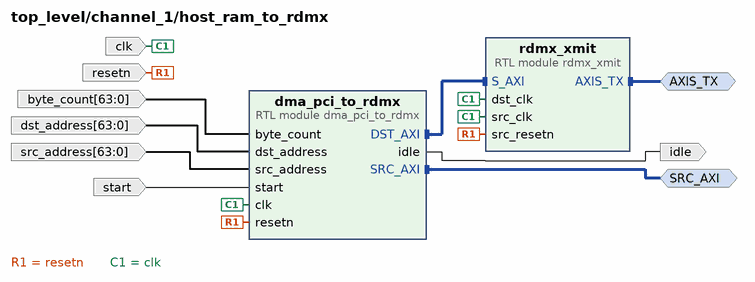
[diagram p20: block diagram inside /channel_1/host_ram_to_rdmx]
create_bd_intf_pin -mode Master -vlnv xilinx.com:interface:aximm_rtl:1.0 SRC_AXI
create_bd_intf_pin -mode Master -vlnv xilinx.com:interface:axis_rtl:1.0 AXIS_TX
create_bd_pin -dir I -type clk clk
create_bd_pin -dir I -type rst resetn
create_bd_pin -dir I -from 63 -to 0 src_address
create_bd_pin -dir I start
create_bd_pin -dir O idle
create_bd_pin -dir I -from 63 -to 0 dst_address
create_bd_pin -dir I -from 63 -to 0 byte_count

create_bd_cell -type module -reference rdmx_xmit rdmx_xmit
set_property -dict {CONFIG.FIFO_CLOCK_MODE common_clock CONFIG.SRC_MAC 1} [get_bd_cells rdmx_xmit]
create_bd_cell -type module -reference dma_pci_to_rdmx dma_pci_to_rdmx

# ---- hierarchy /channel_1/packet_buffer ----
current_bd_instance /channel_1/packet_buffer
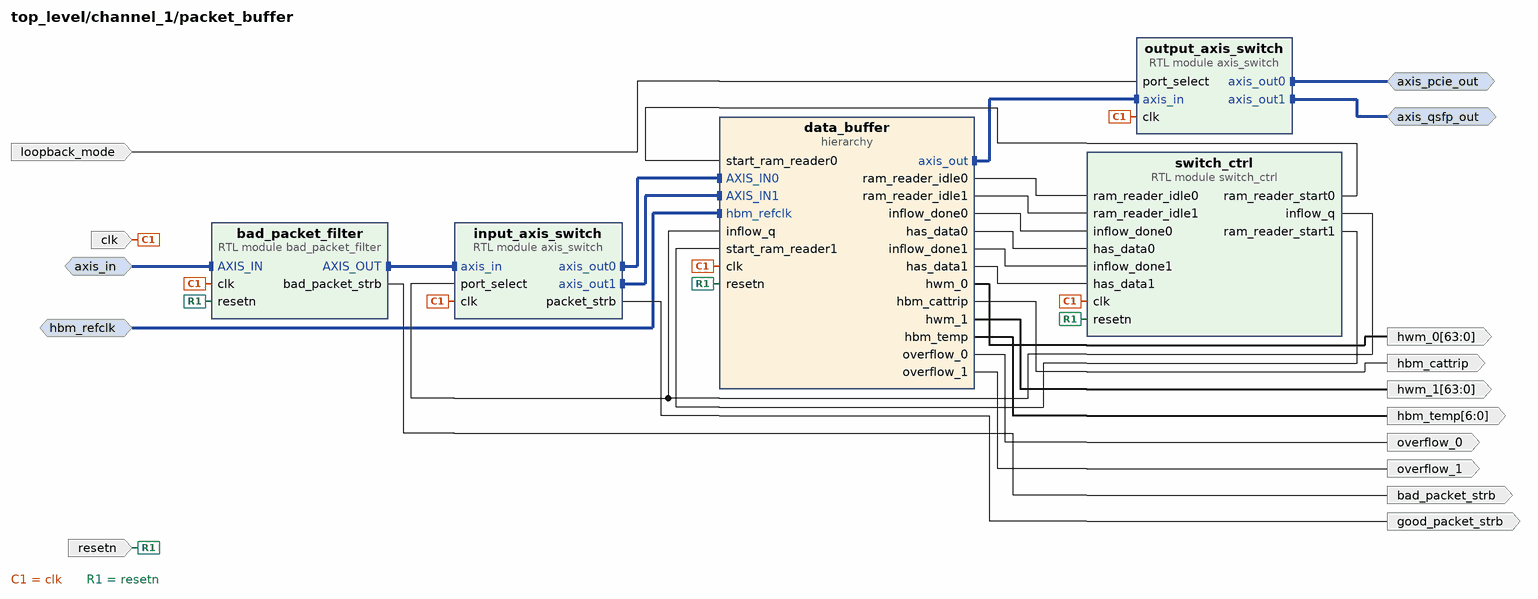
[diagram p21: block diagram inside /channel_1/packet_buffer]
create_bd_intf_pin -mode Slave -vlnv xilinx.com:interface:axis_rtl:1.0 axis_in
create_bd_intf_pin -mode Master -vlnv xilinx.com:interface:axis_rtl:1.0 axis_pcie_out
create_bd_intf_pin -mode Master -vlnv xilinx.com:interface:axis_rtl:1.0 axis_qsfp_out
create_bd_intf_pin -mode Slave -vlnv xilinx.com:interface:diff_clock_rtl:1.0 hbm_refclk
create_bd_pin -dir I -type clk clk
create_bd_pin -dir I resetn
create_bd_pin -dir O -from 63 -to 0 hwm_0
create_bd_pin -dir O -from 63 -to 0 hwm_1
create_bd_pin -dir I loopback_mode
create_bd_pin -dir O overflow_0
create_bd_pin -dir O overflow_1
create_bd_pin -dir O bad_packet_strb
create_bd_pin -dir O good_packet_strb
create_bd_pin -dir O -from 6 -to 0 hbm_temp
create_bd_pin -dir O hbm_cattrip

create_bd_cell -type module -reference axis_switch input_axis_switch
create_bd_cell -type module -reference axis_switch output_axis_switch
create_bd_cell -type module -reference switch_ctrl switch_ctrl
create_bd_cell -type hier data_buffer
create_bd_cell -type module -reference bad_packet_filter bad_packet_filter

# ---- hierarchy /channel_1/packet_buffer/data_buffer ----
current_bd_instance /channel_1/packet_buffer/data_buffer
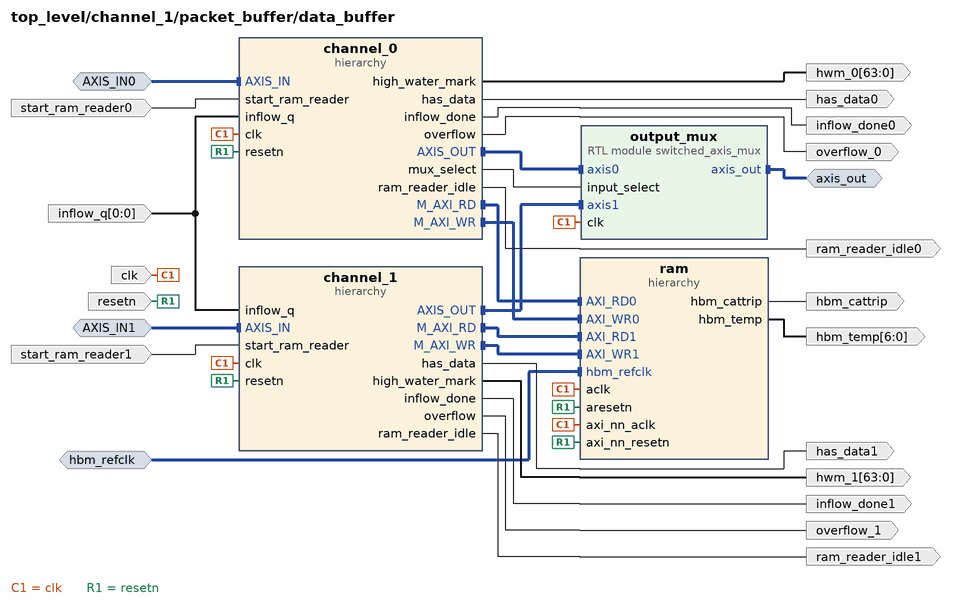
[diagram p22: block diagram inside /channel_1/packet_buffer/data_buffer]
create_bd_intf_pin -mode Slave -vlnv xilinx.com:interface:diff_clock_rtl:1.0 hbm_refclk
create_bd_intf_pin -mode Slave -vlnv xilinx.com:interface:axis_rtl:1.0 AXIS_IN0
create_bd_intf_pin -mode Slave -vlnv xilinx.com:interface:axis_rtl:1.0 AXIS_IN1
create_bd_intf_pin -mode Master -vlnv xilinx.com:interface:axis_rtl:1.0 axis_out
create_bd_pin -dir I -type clk clk
create_bd_pin -dir I resetn
create_bd_pin -dir O -from 6 -to 0 hbm_temp
create_bd_pin -dir O hbm_cattrip
create_bd_pin -dir I -from 0 -to 0 inflow_q
create_bd_pin -dir O ram_reader_idle0
create_bd_pin -dir I start_ram_reader0
create_bd_pin -dir O has_data0
create_bd_pin -dir O inflow_done0
create_bd_pin -dir O -from 63 -to 0 hwm_0
create_bd_pin -dir O overflow_0
create_bd_pin -dir O has_data1
create_bd_pin -dir O inflow_done1
create_bd_pin -dir O -from 63 -to 0 hwm_1
create_bd_pin -dir O overflow_1
create_bd_pin -dir O ram_reader_idle1
create_bd_pin -dir I start_ram_reader1

create_bd_cell -type hier ram
create_bd_cell -type hier channel_0
create_bd_cell -type hier channel_1
create_bd_cell -type module -reference switched_axis_mux output_mux

# ---- hierarchy /channel_1/packet_buffer/data_buffer/ram ----
current_bd_instance /channel_1/packet_buffer/data_buffer/ram
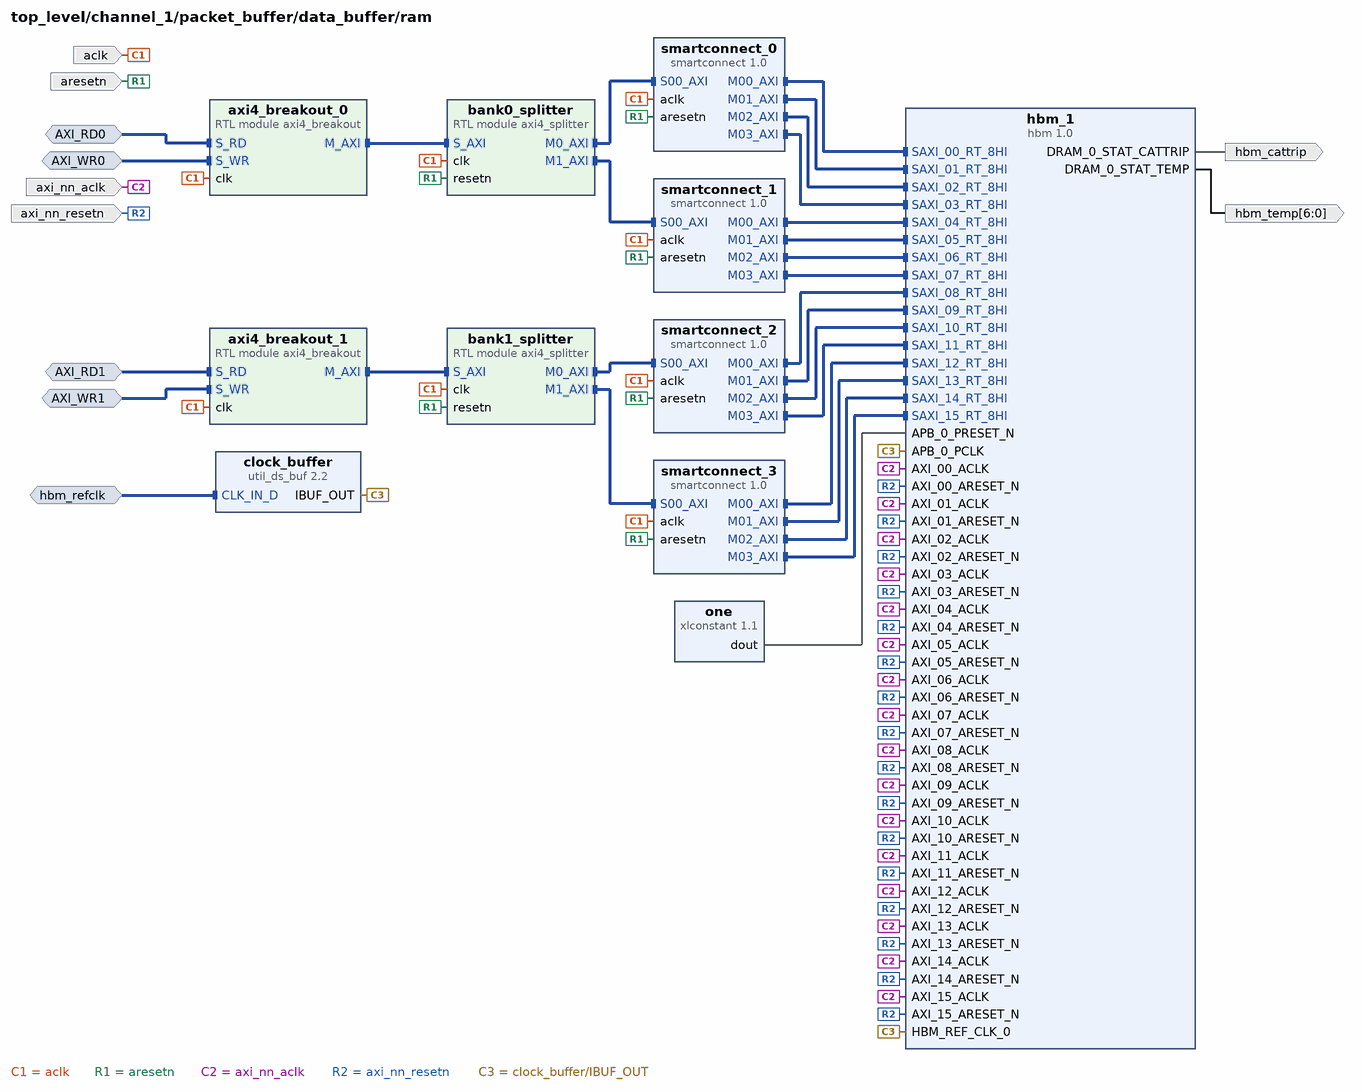
[diagram p23: block diagram inside /channel_1/packet_buffer/data_buffer/ram]
create_bd_intf_pin -mode Slave -vlnv xilinx.com:interface:aximm_rtl:1.0 AXI_WR1
create_bd_intf_pin -mode Slave -vlnv xilinx.com:interface:aximm_rtl:1.0 AXI_RD1
create_bd_intf_pin -mode Slave -vlnv xilinx.com:interface:aximm_rtl:1.0 AXI_WR0
create_bd_intf_pin -mode Slave -vlnv xilinx.com:interface:aximm_rtl:1.0 AXI_RD0
create_bd_intf_pin -mode Slave -vlnv xilinx.com:interface:diff_clock_rtl:1.0 hbm_refclk
create_bd_pin -dir I -type clk axi_nn_aclk
create_bd_pin -dir I axi_nn_resetn
create_bd_pin -dir O -from 6 -to 0 hbm_temp
create_bd_pin -dir O hbm_cattrip
create_bd_pin -dir I aclk
create_bd_pin -dir I aresetn

create_bd_cell -type ip -vlnv xilinx.com:ip:hbm:1.0 hbm_1
set_property -dict [list \
  CONFIG.USER_APB_EN false \
  CONFIG.USER_MC0_ENABLE_ECC_CORRECTION true \
  CONFIG.USER_MC0_TRAFFIC_OPTION Linear \
  CONFIG.USER_MC10_ENABLE_ECC_CORRECTION true \
  CONFIG.USER_MC10_TRAFFIC_OPTION Linear \
  CONFIG.USER_MC11_ENABLE_ECC_CORRECTION true \
  CONFIG.USER_MC11_TRAFFIC_OPTION Linear \
  CONFIG.USER_MC12_ENABLE_ECC_CORRECTION true \
  CONFIG.USER_MC12_TRAFFIC_OPTION Linear \
  CONFIG.USER_MC13_ENABLE_ECC_CORRECTION true \
  CONFIG.USER_MC13_TRAFFIC_OPTION Linear \
  CONFIG.USER_MC14_ENABLE_ECC_CORRECTION true \
  CONFIG.USER_MC14_TRAFFIC_OPTION Linear \
  CONFIG.USER_MC15_ENABLE_ECC_CORRECTION true \
  CONFIG.USER_MC15_TRAFFIC_OPTION Linear \
  CONFIG.USER_MC1_ENABLE_ECC_CORRECTION true \
  CONFIG.USER_MC1_TRAFFIC_OPTION Linear \
  CONFIG.USER_MC2_ENABLE_ECC_CORRECTION true \
  CONFIG.USER_MC2_TRAFFIC_OPTION Linear \
  CONFIG.USER_MC3_ENABLE_ECC_CORRECTION true \
  CONFIG.USER_MC3_TRAFFIC_OPTION Linear \
  CONFIG.USER_MC4_ENABLE_ECC_CORRECTION true \
  CONFIG.USER_MC4_TRAFFIC_OPTION Linear \
  CONFIG.USER_MC5_ENABLE_ECC_CORRECTION true \
  CONFIG.USER_MC5_TRAFFIC_OPTION Linear \
  CONFIG.USER_MC6_ENABLE_ECC_CORRECTION true \
  CONFIG.USER_MC6_TRAFFIC_OPTION Linear \
  CONFIG.USER_MC7_ENABLE_ECC_CORRECTION true \
  CONFIG.USER_MC7_TRAFFIC_OPTION Linear \
  CONFIG.USER_MC8_ENABLE_ECC_CORRECTION true \
  CONFIG.USER_MC8_TRAFFIC_OPTION Linear \
  CONFIG.USER_MC9_ENABLE_ECC_CORRECTION true \
  CONFIG.USER_MC9_TRAFFIC_OPTION Linear \
  CONFIG.USER_SINGLE_STACK_SELECTION RIGHT \
  CONFIG.USER_SWITCH_ENABLE_00 FALSE \
] [get_bd_cells hbm_1]
create_bd_cell -type ip -vlnv xilinx.com:ip:smartconnect:1.0 smartconnect_0
set_property -dict {CONFIG.NUM_MI 4 CONFIG.NUM_SI 1} [get_bd_cells smartconnect_0]
create_bd_cell -type ip -vlnv xilinx.com:ip:smartconnect:1.0 smartconnect_1
set_property -dict {CONFIG.NUM_MI 4 CONFIG.NUM_SI 1} [get_bd_cells smartconnect_1]
create_bd_cell -type ip -vlnv xilinx.com:ip:smartconnect:1.0 smartconnect_2
set_property -dict {CONFIG.NUM_MI 4 CONFIG.NUM_SI 1} [get_bd_cells smartconnect_2]
create_bd_cell -type ip -vlnv xilinx.com:ip:smartconnect:1.0 smartconnect_3
set_property -dict {CONFIG.NUM_MI 4 CONFIG.NUM_SI 1} [get_bd_cells smartconnect_3]
create_bd_cell -type ip -vlnv xilinx.com:ip:xlconstant:1.1 one
create_bd_cell -type ip -vlnv xilinx.com:ip:util_ds_buf:2.2 clock_buffer
create_bd_cell -type module -reference axi4_breakout axi4_breakout_0
create_bd_cell -type module -reference axi4_breakout axi4_breakout_1
create_bd_cell -type module -reference axi4_splitter bank0_splitter
set_property -dict {CONFIG.BASE_ADDR0 0x0000000200000000 CONFIG.BASE_ADDR1 0x0000000280000000} [get_bd_cells bank0_splitter]
create_bd_cell -type module -reference axi4_splitter bank1_splitter
set_property -dict {CONFIG.BASE_ADDR0 0x0000000300000000 CONFIG.BASE_ADDR1 0x0000000380000000} [get_bd_cells bank1_splitter]

# ---- hierarchy /channel_1/packet_buffer/data_buffer/channel_0 ----
current_bd_instance /channel_1/packet_buffer/data_buffer/channel_0
